# EAGLE schematic uc4h airspeed v020-wholes (EAGLE 7.5.0)
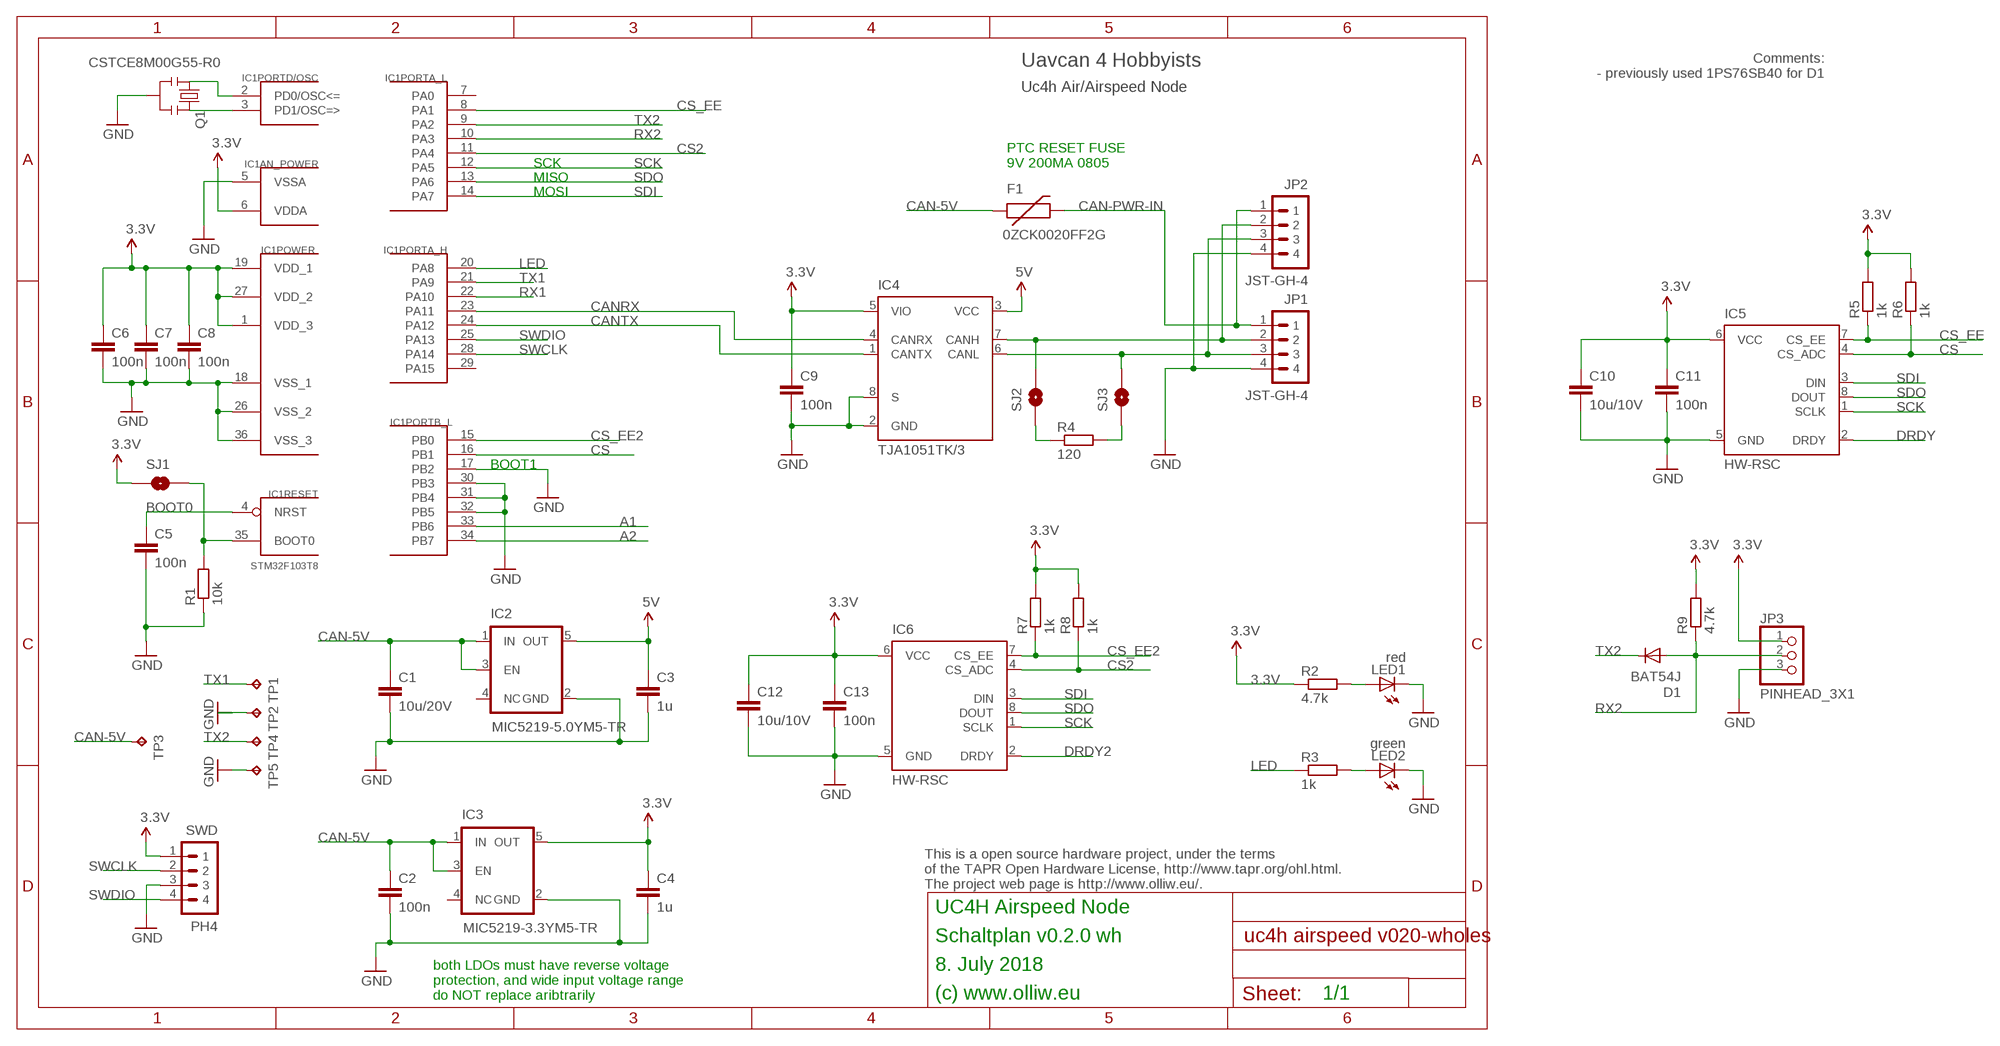
[diagram p0: schematic, sheet 1]

## Parts
C1  10u/20V  C-EUC1206  [C1206]
C2  100n  C-EUC0603K  [C0603K]
C3  1u  C-EUC0603K  [C0603K]
C4  1u  C-EUC0603K  [C0603K]
C5  100n  C-EUC0603K  [C0603K]
C6  100n  C-EUC0603K  [C0603K]
C7  100n  C-EUC0603K  [C0603K]
C8  100n  C-EUC0603K  [C0603K]
C9  100n  C-EUC0603K  [C0603K]
C10  10u/10V  C-EUC1206  [C1206]
C11  100n  C-EUC0603K  [C0603K]
C12  10u/10V  C-EUC1206  [C1206]
C13  100n  C-EUC0603K  [C0603K]
D1  BAT54J  DIODE-SOD110-R  [SOD110-R]
F1  0ZCK0020FF2G  FUSE-PTCFUSE-0805  [FUSE-0805]
IC1  STM32F103T8  STM32F10XTXU6  [VFQFPN36]
IC2  MIC5219-5.0YM5-TR  V_REG_TPS76433SOT23-5  [SOT23-5]
IC3  MIC5219-3.3YM5-TR  V_REG_TPS76433SOT23-5  [SOT23-5]
IC4  TJA1051TK/3  [HVSON8]
IC5  HW-RSC  [HONEYWELL-8]
IC6  HW-RSC  [HONEYWELL-8]
JP1  JST-GH-4  [SM04B-GHS-TB]
JP2  JST-GH-4  [SM04B-GHS-TB]
JP3  PINHEAD_3X1  [PINHEAD_3X1]
LED1  red  LEDCHIPLED_0603  [CHIPLED_0603]
LED2  green  LEDCHIPLED_0603  [CHIPLED_0603]
Q1  CSTCE8M00G55-R0  RESONATORSMD  [RESONATOR-SMD]
R1  10k  R-EU_R0603  [R0603]
R2  4.7k  R-EU_R0603  [R0603]
R3  1k  R-EU_R0603  [R0603]
R4  120  R-EU_R0603  [R0603]
R5  1k  R-EU_R0603  [R0603]
R6  1k  R-EU_R0603  [R0603]
R7  1k  R-EU_R0603  [R0603]
R8  1k  R-EU_R0603  [R0603]
R9  4.7k  R-EU_R0603  [R0603]
SJ1  BOOT0  SOLDERJUMPERNO  [SJ_2S-NO]
SJ2  SOLDERJUMPERNO  [SJ_2S-NO]
SJ3  SOLDERJUMPERNO  [SJ_2S-NO]
SWD  PH4  P4X1_1P27-OCT_BILEX  [4X1_1P27_OCT_BILEX]
TP1  TPB1,27  [B1,27]
TP2  TPB1,27  [B1,27]
TP3  TPB1,27  [B1,27]
TP4  TPB1,27  [B1,27]
TP5  TPB1,27  [B1,27]

## Nets
3.3V: C4.1 C6.1 C7.1 C8.1 C9.1 C10.1 C11.1 C12.1 C13.1 IC1.1(POWER:VDD_3) IC1.6(AN_POWER:VDDA) IC1.19(POWER:VDD_1) IC1.27(POWER:VDD_2) IC3.5(OUT) IC4.5(VIO) IC5.6(VCC) IC6.6(VCC) JP3.1 R2.1 R5.2 R6.2 R7.2 R8.2 R9.2 SJ1.1 SWD.1
5V: C3.1 IC2.5(OUT) IC4.3(VCC)
A1: IC1.33(PORTB_L:PB6)
A2: IC1.34(PORTB_L:PB7)
CAN-5V: C1.1 C2.1 F1.1 IC2.1(IN) IC2.3(EN) IC3.1(IN) IC3.3(EN) TP3.TP
CAN-PWR-IN: F1.2 JP1.1 JP2.1
CANH: IC4.7(CANH) JP1.2 JP2.2 SJ2.2
CANL: IC4.6(CANL) JP1.3 JP2.3 SJ3.2
CANRX: IC1.23(PORTA_H:PA11) IC4.4(CANRX)
CANTX: IC1.24(PORTA_H:PA12) IC4.1(CANTX)
CS: IC1.16(PORTB_L:PB1) IC5.4(CS_ADC) R6.1
CS2: IC1.11(PORTA_L:PA4) IC6.4(CS_ADC) R8.1
CS_EE: IC1.8(PORTA_L:PA1) IC5.7(CS_EE) R5.1
CS_EE2: IC1.15(PORTB_L:PB0) IC6.7(CS_EE) R7.1
DRDY: IC5.2(DRDY)
DRDY2: IC6.2(DRDY)
GND: C1.2 C2.2 C3.2 C4.2 C5.2 C6.2 C7.2 C8.2 C9.2 C10.2 C11.2 C12.2 C13.2 IC1.5(AN_POWER:VSSA) IC1.17(PORTB_L:PB2) IC1.18(POWER:VSS_1) IC1.26(POWER:VSS_2) IC1.30(PORTB_L:PB3) IC1.31(PORTB_L:PB4) IC1.32(PORTB_L:PB5) IC1.36(POWER:VSS_3) IC2.2(GND) IC3.2(GND) IC4.2(GND) IC4.8(S) IC5.5(GND) IC6.5(GND) JP1.4 JP2.4 JP3.3 LED1.C LED2.C Q1.2 R1.1 SWD.3 TP2.TP TP5.TP
LED: IC1.20(PORTA_H:PA8) R3.1
N$1: C5.1 IC1.4(RESET:NRST)
N$2: LED2.A R3.2
N$4: R4.1 SJ2.1
N$5: IC1.2(PORTD/OSC:PD0/OSC<=) Q1.1
N$6: IC1.3(PORTD/OSC:PD1/OSC=>) Q1.3
N$7: R4.2 SJ3.1
N$8: IC1.35(RESET:BOOT0) R1.2 SJ1.2
N$9: LED1.A R2.2
RX1: IC1.22(PORTA_H:PA10)
RX2: D1.A IC1.10(PORTA_L:PA3) JP3.2 R9.1
SCK: IC1.12(PORTA_L:PA5) IC5.1(SCLK) IC6.1(SCLK)
SDI: IC1.14(PORTA_L:PA7) IC5.3(DIN) IC6.3(DIN)
SDO: IC1.13(PORTA_L:PA6) IC5.8(DOUT) IC6.8(DOUT)
SWCLK: IC1.28(PORTA_H:PA14) SWD.2
SWDIO: IC1.25(PORTA_H:PA13) SWD.4
TX1: IC1.21(PORTA_H:PA9) TP1.TP
TX2: D1.C IC1.9(PORTA_L:PA2) TP4.TP
Unconnected: IC1.7(PORTA_L:PA0) IC1.29(PORTA_H:PA15) IC2.4(NC) IC3.4(NC)

## Notes on the sheet
- Comments:
  - previously used 1PS76SB40 for D1
- Uavcan 4 Hobbyists
- Uc4h Air/Airspeed Node
- SCK
- PTC RESET FUSE
  9V 200MA 0805
- MISO
- MOSI
- BOOT1
- This is a open source hardware project, under the terms
  of the TAPR Open Hardware License, http://www.tapr.org/ohl.html.
  The project web page is http://www.olliw.eu/.
- UC4H Airspeed Node
- Schaltplan v0.2.0 wh
- 8. July 2018
- both LDOs must have reverse voltage
  protection, and wide input voltage range
  do NOT replace aribtrarily
- (c) www.olliw.eu | 1/1

## Library data of the parts
C1-C13 = rcl:C-EU: CAPACITOR, European symbol
D1 = diode:DIODE-: DIODE
F1 = # stdlib:FUSE-PTC
IC1 = # stm32:STM32F10XTXU6: STM32F101/103 36pad VFQPFN36
IC2 IC3 = # SparkFun2:V_REG_TPS76433: Voltage Regulator Older TI part. LDO 150mA regulator. No output by-pass cap option. See V_REG_LDO for a better part.
IC4 = # stdlib:TJA1051TK/3
IC5 IC6 = # stdlib:HW-RSC
JP1 JP2 = # stdlib:JST-GH-4
JP3 = # stdlib:PINHEAD_3X1
LED1 LED2 = led:LED: LED OSRAM: - CHIPLED LG R971, LG N971, LY N971, LG Q971, LY Q971, LO R971, LY R971 LH N974, LH R974 LS Q976, LO Q976, LY Q976 LO Q996 - Hyper CHIPLED LW Q18S LB Q993, LB Q99A, LB R99A - SideLED LS A670, LO A670, LY A670, LG A670, LP A670 LB A673, LV A673, LT A673, LW A673 LH A674 LY A675 LS A676, LA A676, LO A676, LY A676, LW A676 LS A679, LY A679, LG A679 - Hyper Micro SIDELED® LS Y876, LA Y876, LO Y876, LY Y876 LT Y87S - SmartLED LW L88C, LW L88S LB L89C, LB L89S, LG L890 LS L89K, LO L89K, LY L89K LS L896, LA L896, LO L896, LY L896 - TOPLED LS T670, LO T670, LY T670, LG T670, LP T670 LSG T670, LSP T670, LSY T670, LOP T670, LYG T670 LG T671, LOG T671, LSG T671 LB T673, LV T673, LT T673, LW T673 LH T674 LS T676, LA T676, LO T676, LY T676, LB T676, LH T676, LSB T676, LW T676 LB T67C, LV T67C, LT T67C, LS T67K, LO T67K, LY T67K, LW E67C LS E67B, LA E67B, LO E67B, LY E67B, LB E67C, LV E67C, LT E67C LW T67C LS T679, LY T679, LG T679 LS T770, LO T770, LY T770, LG T770, LP T770 LB T773, LV T773, LT T773, LW T773 LH T774 LS E675, LA E675, LY E675, LS T675 LS T776, LA T776, LO T776, LY T776, LB T776 LHGB T686 LT T68C, LB T68C - Hyper Mini TOPLED® LB M676 - Mini TOPLED Santana® LG M470 LS M47K, LO M47K, LY M47K Source: http://www.osram.convergy.de LUXEON: - LUMILED® LXK2-PW12-R00, LXK2-PW12-S00, LXK2-PW14-U00, LXK2-PW14-V00 LXK2-PM12-R00, LXK2-PM12-S00, LXK2-PM14-U00 LXK2-PE12-Q00, LXK2-PE12-R00, LXK2-PE12-S00, LXK2-PE14-T00, LXK2-PE14-U00 LXK2-PB12-K00, LXK2-PB12-L00, LXK2-PB12-M00, LXK2-PB14-N00, LXK2-PB14-P00, LXK2-PB14-Q00 LXK2-PR12-L00, LXK2-PR12-M00, LXK2-PR14-Q00, LXK2-PR14-R00 LXK2-PD12-Q00, LXK2-PD12-R00, LXK2-PD12-S00 LXK2-PH12-R00, LXK2-PH12-S00 LXK2-PL12-P00, LXK2-PL12-Q00, LXK2-PL12-R00 Source: www.luxeon.com KINGBRIGHT: KA-3528ASYC Source: www.kingbright.com
Q1 = # SparkFun2:RESONATOR: Resonator Small SMD resonator. This is the itty bitty 10/20MHz resonators with built in caps. CSTCE10M0G55 and CSTCE20M0V53. Footprint has been reviewed closely but hasn't been tested yet.
R1-R9 = rcl:R-EU_: RESISTOR, European symbol
SJ1-SJ3 = # SparkFun2:SOLDERJUMPER: Solder Jumper Standard SMD solder jumper. Used to automate production. Two varients : Normally Open and Normally Closed are the same, but have different paste layers. NC will have a large amount of paste and should jumper during reflow.
SWD = # stdlib:P4X1_1P27
TP1-TP5 = testpad:TP: Test pad